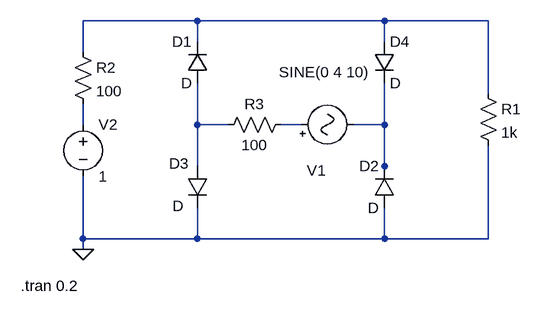
[diagram p0: schematic ponte_di _Cowan_basic.asc]
ponte_di _Cowan_basic.asc, the LTspice schematic file:
Version 4
SHEET 1 1024 680
WIRE 96 16 -80 16
WIRE 384 16 96 16
WIRE 544 16 384 16
WIRE 96 48 96 16
WIRE 384 48 384 16
WIRE -80 64 -80 16
WIRE 544 128 544 16
WIRE -80 176 -80 144
WIRE 96 176 96 112
WIRE 144 176 96 176
WIRE 256 176 224 176
WIRE 384 176 384 112
WIRE 384 176 336 176
WIRE 96 240 96 176
WIRE 384 240 384 176
WIRE 384 256 384 240
WIRE -80 352 -80 256
WIRE 96 352 96 304
WIRE 96 352 -80 352
WIRE 384 352 384 304
WIRE 384 352 96 352
WIRE 544 352 544 208
WIRE 544 352 384 352
WIRE -80 368 -80 352
FLAG -80 368 0
SYMBOL diode 112 112 R180
WINDOW 0 24 64 Left 2
WINDOW 3 24 0 Left 2
SYMATTR InstName D1
SYMBOL diode 400 304 R180
WINDOW 0 24 64 Left 2
WINDOW 3 24 0 Left 2
SYMATTR InstName D2
SYMBOL diode 80 240 R0
WINDOW 0 -28 -4 Left 2
WINDOW 3 -22 61 Left 2
SYMATTR InstName D3
SYMBOL diode 368 48 R0
SYMATTR InstName D4
SYMBOL voltage -80 160 R0
WINDOW 123 0 0 Left 2
WINDOW 39 24 124 Left 2
SYMATTR InstName V2
SYMATTR Value 1
SYMBOL res 528 112 R0
SYMATTR InstName R1
SYMATTR Value 1k
SYMBOL Misc\\signal 240 176 R270
WINDOW 0 -55 39 VBottom 2
WINDOW 3 65 51 VTop 2
WINDOW 123 0 0 Left 2
WINDOW 39 0 0 Left 2
SYMATTR InstName V1
SYMATTR Value SINE(0 4 10)
SYMBOL res -96 48 R0
SYMATTR InstName R2
SYMATTR Value 100
SYMBOL res 128 192 R270
WINDOW 0 32 56 VTop 2
WINDOW 3 0 56 VBottom 2
SYMATTR InstName R3
SYMATTR Value 100
TEXT -176 424 Left 2 !.tran 0.2

The netlist it stands for:
* ponte_di _Cowan_basic.asc
D1 N003 N001 D
D2 0 N005 D
D3 N003 0 D
D4 N001 N005 D
V2 N002 0 1
R1 N001 0 1k
V1 N004 N005 SINE(0 4 10)
R2 N001 N002 100
R3 N003 N004 100
.model D D
.lib standard.dio
.tran 0.2
.backanno
.end